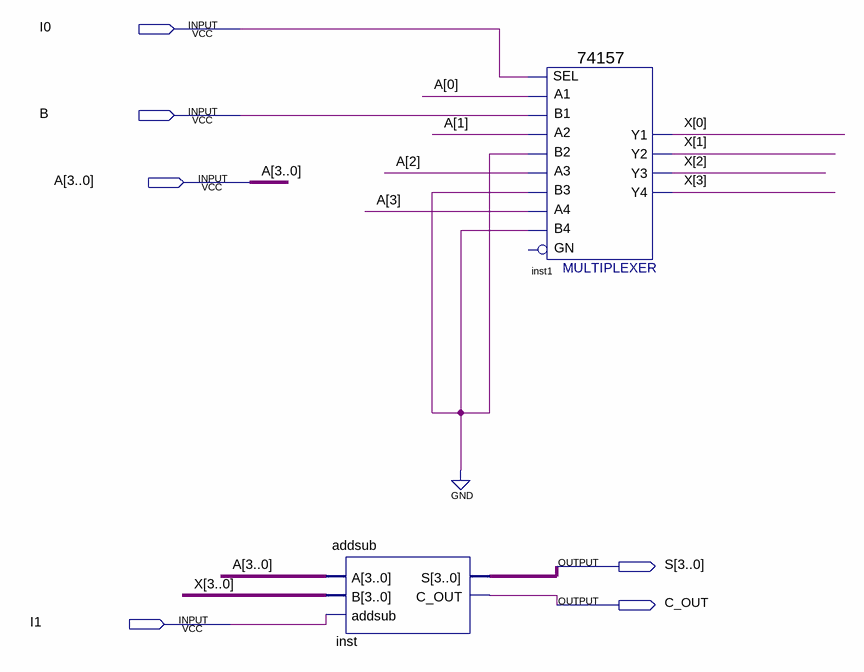
[diagram p0: schematic sheet]
// Quartus schematic fouropalu.bdf as structural Verilog: 2 symbols, 6 pins
module fouropalu (
  input  I0,
  input  B,
  input  [3:0] A,
  input  I1,
  output [3:0] S,
  output C_OUT
);

  wire [3:0] X;

  addsub inst (.A(A), .B(X), .addsub(I1), .S(S), .C_OUT(C_OUT));
  \74157  inst1 (
    .A1(A[0]), .B1(B), .B2(1'b0), .A3(A[2]), .B3(1'b0), .A2(A[1]), .B4(1'b0), .A4(A[3]), .SEL(I0), .Y2(X[1]),
    .Y1(X[0]), .Y4(X[3]), .Y3(X[2]));  // open: GN
endmodule
